# Altium schematic sheet Source.SchDoc
size A4; SheetNumber: 2; SheetTotal: 3
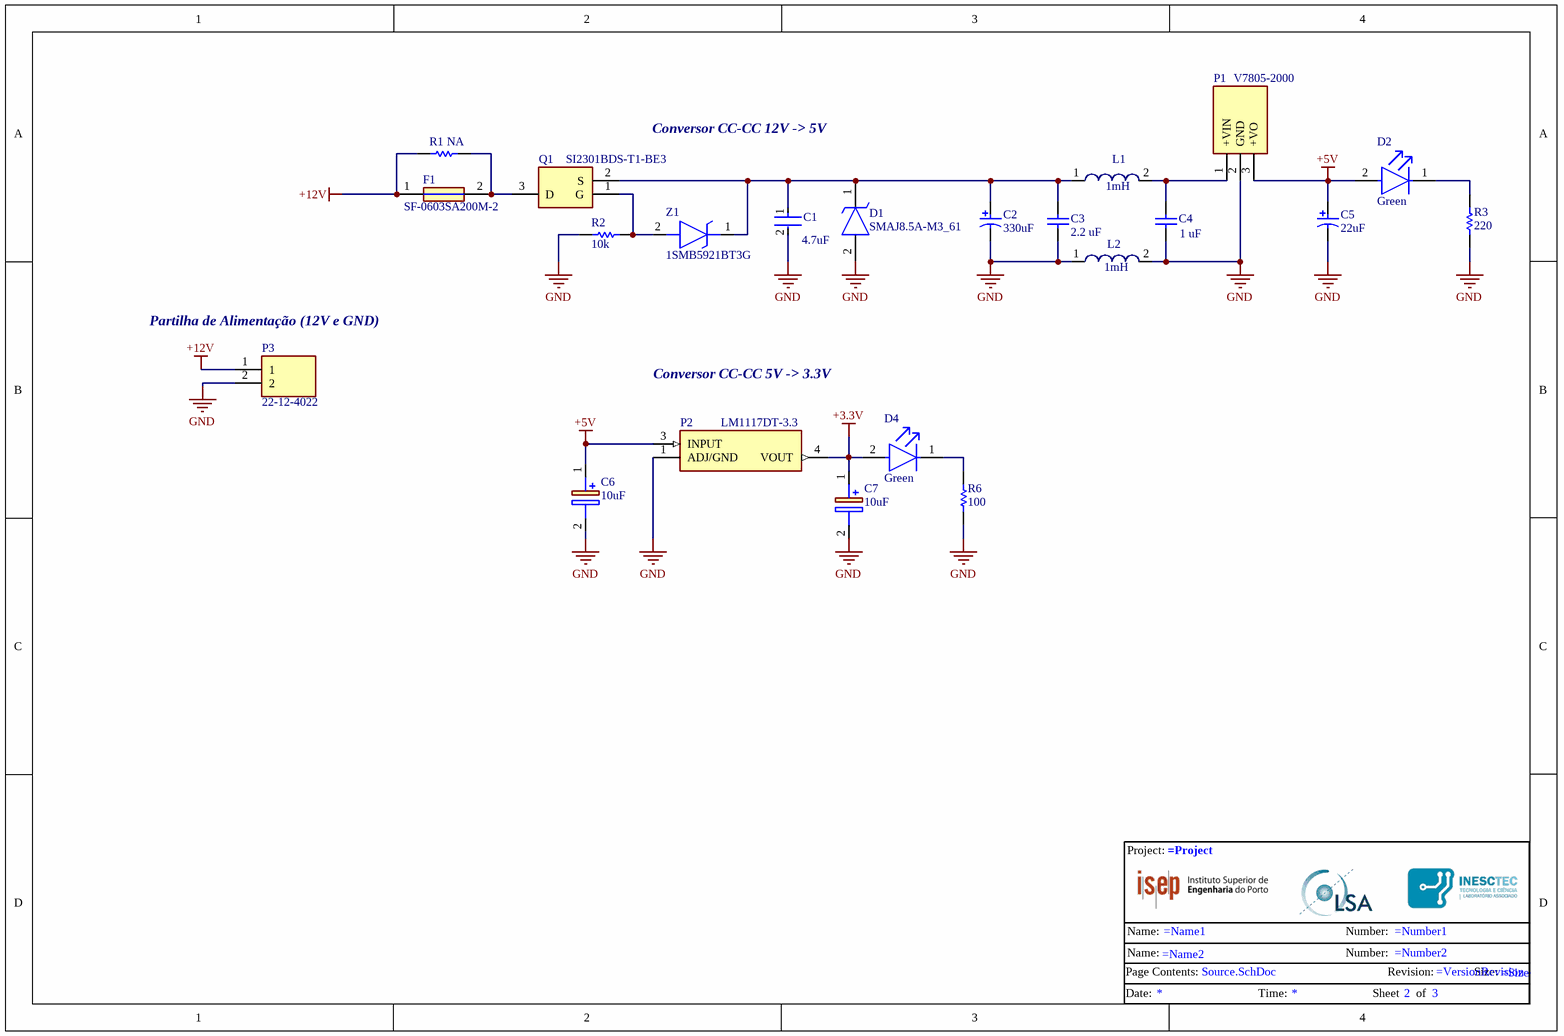
[diagram p0: Source.SchDoc]

## Parts
?  Title_Block  (value not drawn)  (graphical)
C1  4.7uF  [FP-C0603-CG-MFG]
C2  330uF  [NIC-CAPA2-8X10_V]
C3  2.2 uF  [CAPC2013X152X50ML20T25]
C4  1 uF  [CAPC3216X180X50ML20T25]
C5  22uF  [AVX-TAJ-B-2_M]
C6  10uF  [CAPPM3216X180N]
C7  10uF  [CAPPM3216X180N]
D1  SMAJ8.5A-M3_61  [DIOM5127X229N]
D2  Green  [FP-6_541-5056_01-4-MFG]
D4  Green  [FP-6_541-5056_01-4-MFG]
F1  SF-0603SA200M-2  [FUSC1608X95N]
L1  1mH  [1060]
L2  1mH  [1060]
P1  V7805-2000  [V78052000]
P2  LM1117DT-3.3  [TO228P991X238-3N]
P3  22-12-4022  [SHDRRA2W64P0X254_1X2_508X1170X580P]
Q1  SI2301BDS-T1-BE3  [SOT95P237X112-3N]
R1  NA  [RESC1608X55X30ML20T20]
R2  10k  [RESC1608X55X30ML20T20]
R3  220  [RESC1608X55X30ML20T20]
R6  100  [RESC1608X55X30ML20T20]
Z1  1SMB5921BT3G  [DIOM5436X247N]

## Nets
+3.3V: C7.1(+) D4.2(A) P2.4(VOUT)
+5V: C5.1 C6.1(+) D2.2(A) P1.3(+VO) P2.3(INPUT)
+12V: F1.1 P3.1 R1.2
GND: C1.2 C2.2 C3.1 C4.1 C5.2 C6.2(-) C7.2(-) D1.2(A) L2.1 L2.2 P1.2(GND) P2.1(ADJ/GND) P3.2 R2.2 R3.1 R6.1
NetC1_1: C1.1 C2.1 C3.2 D1.1(K) L1.1 Q1.2(S) Z1.1(K)
NetC4_2: C4.2 L1.2 P1.1(+VIN)
NetD2_1: D2.1(C) R3.2
NetD4_1: D4.1(C) R6.2
NetF1_2: F1.2 Q1.3(D) R1.1
NetQ1_1: Q1.1(G) R2.1 Z1.2(A)

## Notes on the sheet
- Conversor CC-CC 12V -> 5V
- (near P3) Partilha de Alimentação (12V e GND)
- Conversor CC-CC 5V -> 3.3V
- (in symbol Title_Block) Project:; Name:; Number:; Page Contents:; Revision:; Size:; Date:; Time:; Sheet; of

## Library data of the parts
C1 = CMP-2006-02256-2: CAP CER 4.7UF 6.3V X5R 0603; Manufacturer: Kemet; Manufacturer Part Number: C0603C475K9PACTU; Temperature Coefficient: 15%; Tolerance: 10%; Material: Ceramic; Device Class L3: Ceramic Capacitors; RoHS: TRUE; Value: 4.7uF; Lead Free: Yes; ComponentLink2Description: Datasheet; Mouser Description: Multilayer Ceramic Capacitors MLCC - SMD/SMT 6.3volts 4.7uF X5R 10%; Package: C0603-CG; Digikey Description: CAP CER 4.7UF 6.3V X5R 0603; ComponentLink2URL: https://content.kemet.com/datasheets/KEM_C1006_X5R_SMD.pdf; Category: Cap; Temperature Range Low: -55°C; Capacitance: 4.7uF; Temperature: -55°C to +85°C; Octopart: https://octopart.com/c0603c475k9pactu-kemet-104242; Ipc Land Pattern Name: CAPC16080X80; Voltage Rating: 6.3V; Temperature Range High: +85°C; Height: 0.9mm; Temperature Characteristic: X5R; Device Class L1: Passive Components; Automotive: No; Device Class L2: Capacitors
C2 = CMP-0687-00068-1: Aluminum Electrolytic Capacitor, UD Series, Low Impedance, 330 uF, 25 V, + / - 20%, -55 to 105 degC, Chip Type, 8 x 10 mm D x L, Pb-Free, Reel; PartNumber: UUD1E331MNL1GS; Manufacturer: Nichicon; Rated Voltage: 25 V; Tolerance Rated Capacitance: -20 to 20%; Packing: Dia382mm Reel; Impedance: 0.17 Ohm; Rated Ripple Current (at 100kHz): 450 mA; Endurance Time: 5000 h; ComponentLink3URL: http://products.nichicon.co.jp/en/pdf/XJA043/e-ud.pdf; PackageDescription: 2-Pin Surface Mount Device, Diameter 8 mm, Height 10 mm, Pitch 6.5 mm; ComponentLink1URL: http://www.nichicon.co.jp/; PackageReference: CAPAE-D8H10; ComponentLink1Description: Manufacturer URL; ComponentLink2Description: Datasheet; DatasheetVersion: 08/2012; RoHS: TRUE; Diameter: 8 mm; Mounting Technology: Surface Mount; ComponentLink2URL: http://products.nichicon.co.jp/en/pdf/XJA043/e-ud.pdf; ComponentLink3Description: Package Specification; Rated Capacitance: 330 uF; Length: 10 mm
C3 = CMP-2007-04514-1: Part Number: 08053C225KAT2A; Manufacturer: AVX Interconnect / Elco
C4 = CMP-2000-04991-1: Chip Capacitor, 1 uF, +/- 10%, 25 V, -55 to 125 degC, 1206 (3216 Metric), RoHS, Tape and Reel; Manufacturer: Kemet; Temperature Coefficient / Code: +/-15%; Capacitance: 1uF; Dielectric: X7R; Voltage Rating DC: 25V; Capacitance - nF: 1000nF; Class: Class1; Case Length: 3.2mm; Type: SMDMLCCX7R6.3-250VDCCommericalGrade; Case Width: 1.6mm; Product: GeneralTypeMLCCs; Datasheet URL: https://ciiva.com/datasheet-click-18194173?src=ciiva&sig=6daff8c4; Operating Temperature Range: -55Cto+125C; Series: C1206C; RoHS: Details; Product Category: MultilayerCeramicCapacitorsMLCC-SMD/SMT; Manufacturer URL: http://www.kemet.com/; Minimum Operating Temperature: -55C; Dimensions: 1.6mmWx3.2mmLx1.6mmH; Termination Style: SMD/SMT; Brand: Kemet; Packaging: Reel; Package / Case: 1206(3216metric); Case Code - mm: 3216; Datasheet Version: Jul-14; Factory Pack Quantity: 2000; Package Description: 2-Pin Surface Mount Device, Body 3.2 x 1.6 mm; Tolerance: 10%; Package Reference: 1206; Case Height: 1.6mm; Case Code - in: 1206; Maximum Operating Temperature: +125C; Voltage Rating: 25V
C5 = CMP-2100-03689-1: Standard Tantalum, 22 uF, +/- 10%, 16 V, -55 to 125 degC, 2-Pin SMD (1210), RoHS, Tape and Reel; Manufacturer: AVX; Leakage Current: 3.5uA; Dissipation Factor: 6%; Voltage Rating (DC): 16V; ESR (Equivalent Series Resistance): 2.3Ohm; Polarity: Polar; Package Quantity: 1; Tolerance: 10%; Number of Pins: 2; Manufacturer URL: http://www.avx.com/; Height - Seated (Max): 0.083inch; Case Code (Imperial): 1210; Package Reference: TAJ-B-2; Height: 1.9mm; Depth: 2.8mm; Packaging: TapeandReel; Termination: SMD/SMT; Case/Package: 1210; Lead Free: LeadFree; Min Operating Temperature: -55degC; Capacitance: 22uF; RoHSCompliant: True; Dielectric Material: Tantalum; Case Code (Metric): 3528; Width: 2.8mm; Datasheet URL: http://datasheets.avx.com/TAJ.pdf; Radiation Hardening: No; Package Description: 2-Pin Surface Mount Device, Body 3.5 x 2.85 mm; Length: 3.5mm; Voltage Rating: 16V; Datasheet Version: 42401.0; Max Operating Temperature: 125degC; REACH SVHC: NoSVHC; Voltage: 16V
C6 C7 = T491A106K020AT: Capacitor Polarised; Manufacturer_Name: Kemet; Datasheet Link: https://4donline.ihs.com/images/VipMasterIC/IC/KEME/KEME-S-A0006487387/KEME-S-A0006487387-1.pdf?hkey=52A5661711E402568146F3353EA87419; Height: 1.8mm; Manufacturer_Part_Number: T491A106K020AT; Mouser Part Number: 80-T491A106K020AT; Mouser Price/Stock: https://www.mouser.co.uk/ProductDetail/KEMET/T491A106K020AT?qs=TooEEMgOWu79qKWrUr4%2FRg%3D%3D; Arrow Part Number: T491A106K020AT; Arrow Price/Stock: https://www.arrow.com/en/products/t491a106k020at/kemet-corporation
D1 = SMAJ8.5A-M3_61: TVS Diode (Uni-directional); Manufacturer_Name: Vishay; Manufacturer_Part_Number: SMAJ8.5A-M3/61; Datasheet Link: http://www.alldatasheet.com/view.jsp?Searchword=SMAJ8.5A-M3/61; Height: 2.29mm
D2 D4 = CMP-02520-000009-1: LED GREEN 0603 SMD; Manufacturer Part Number: TLMP1100-GS08; Manufacturer: Vishay; Max Junction Temp: +120°C; Automotive Grade: Grade 3; Reverse Voltage: 6V; Led Orientation: Top View; Forward Voltage: 2.1V; Luminous Intensity: 15mcd; Forward Current: 20mA; Colour: Pure green; Peak Emmision Wavelength: 562nm; Wavelength: 561nm; Viewing Angle: 160°; Power Dissipation: 90mW; Digikey Description: LED GREEN 0603 SMD; Package: 6.541-5056.01-4; Ambient Temperature Range High: +100°C; Height: 0.65mm; Device Class L1: Optoelectronics; Device Class L2: LEDs; Mouser Description: Standard LEDs - SMD Pure Green; Temperature Range High: +120°C; RoHS: TRUE; Ambient Temperature Range Low: -40°C; Temperature: to +120°C; ComponentLink2URL: http://www.vishay.com/docs/83173/tlmb1100.pdf; Lead Free: Yes; Octopart: https://octopart.com/tlmp1100-gs08-vishay-55433993; Automotive: Yes; Device Class L3: unset; ComponentLink2Description: Datasheet; Category: Diode
F1 = SF-0603SA200M-2: Fuse; Manufacturer_Name: Bourns; Datasheet Link: https://www.bourns.com/docs/product-datasheets/sf-0603sa-m.pdf?sfvrsn=b5654bf6_7; Height: 0.95mm; Manufacturer_Part_Number: SF-0603SA200M-2; Mouser Part Number: 652-SF-0603SA200M-2; Mouser Price/Stock: https://www.mouser.co.uk/ProductDetail/Bourns/SF-0603SA200M-2?qs=ljCeji4nMDnUko368dFg%2Fg%3D%3D
L1 L2 = CMP-1387-00004-1: SMD Power Inductor WE-PD HV, L=1000 µH; Manufacturer: Wuerth Elektronik; PartNumber: 7687714102; Inductance: 1000 ÂµH; ComponentLink1Description: Manufacturer URL; ComponentLink2Description: Datasheet; PackageReference: 1060; ComponentLink2URL: http://www.we-online.de/katalog/media/pdf/7687714102.pdf; ComponentLink1URL: http://www.we-online.com
P1 = V7805-2000: Power Supply; Manufacturer_Name: CUI Inc.; Datasheet Link: https://componentsearchengine.com/Datasheets/1/V7805-2000.pdf; Height: 17.5mm; Manufacturer_Part_Number: V7805-2000; Mouser Part Number: 490-V7805-2000; Mouser Price/Stock: https://www.mouser.co.uk/ProductDetail/CUI-Inc/V7805-2000?qs=WyjlAZoYn5278Y2RvahTNg%3D%3D; Arrow Part Number: V7805-2000; Arrow Price/Stock: https://www.arrow.com/en/products/v7805-2000/cui-inc?region=nac
P2 = LM1117DT-3.3_NOPB: Integrated Circuit; Manufacturer_Name: Texas Instruments; Manufacturer_Part_Number: LM1117DT-3.3/NOPB; Datasheet Link: https://datasheet.datasheetarchive.com/originals/distributors/Datasheets-SFU2/DSASFU100036103.pdf; Height: 2.38mm; Mouser Part Number: 926-LM1117DT-3.3NOPB; Mouser Price/Stock: https://www.mouser.co.uk/ProductDetail/Texas-Instruments/LM1117DT-33-NOPB?qs=X1J7HmVL2ZHOT670myqy2w%3D%3D; Arrow Part Number: LM1117DT-3.3/NOPB; Arrow Price/Stock: https://www.arrow.com/en/products/lm1117dt-3.3nopb/texas-instruments
P3 = 22-12-4022: Connector; Manufacturer_Name: Molex; Datasheet Link: https://www.molex.com/pdm_docs/sd/022124022_sd.pdf; Height: 5.8mm; Manufacturer_Part_Number: 22-12-4022; Mouser Part Number: 538-22-12-4022; Mouser Price/Stock: https://www.mouser.co.uk/ProductDetail/Molex/22-12-4022?qs=SdQWveS8jHPGKP%2Fe4QVy2w%3D%3D
Q1 = SI2301BDS-T1-BE3: Integrated Circuit; Manufacturer_Name: Vishay; Datasheet Link: https://www.arrow.com/en/products/si2301bds-t1-be3/vishay?region=nac; Height: 1.12mm; Manufacturer_Part_Number: SI2301BDS-T1-BE3; Mouser Part Number: 78-SI2301BDS-T1-BE3; Mouser Price/Stock: https://www.mouser.co.uk/ProductDetail/Vishay-Siliconix/SI2301BDS-T1-BE3?qs=CiayqK2gdcLKGqyOqDFpxQ%3D%3D; Arrow Part Number: SI2301BDS-T1-BE3; Arrow Price/Stock: https://www.arrow.com/en/products/si2301bds-t1-be3/vishay?region=nac
R1-R3 R6 = CMP-2000-00897-1: Manufacturer: Panasonic; Part Number: ERA3AEB122V
Z1 = 1SMB5921BT3G: Zener Diode; Manufacturer_Name: ON Semiconductor; Datasheet Link: http://www.onsemi.com/pub/Collateral/1SMB5913BT3-D.PDF; Height: 2.47mm; Manufacturer_Part_Number: 1SMB5921BT3G; Mouser Part Number: 863-1SMB5921BT3G; Mouser Price/Stock: https://www.mouser.co.uk/ProductDetail/ON-Semiconductor/1SMB5921BT3G?qs=vLkC5FC1VN%2FJmQCOkKzbLQ%3D%3D; Arrow Part Number: 1SMB5921BT3G; Arrow Price/Stock: https://www.arrow.com/en/products/1smb5921bt3g/on-semiconductor